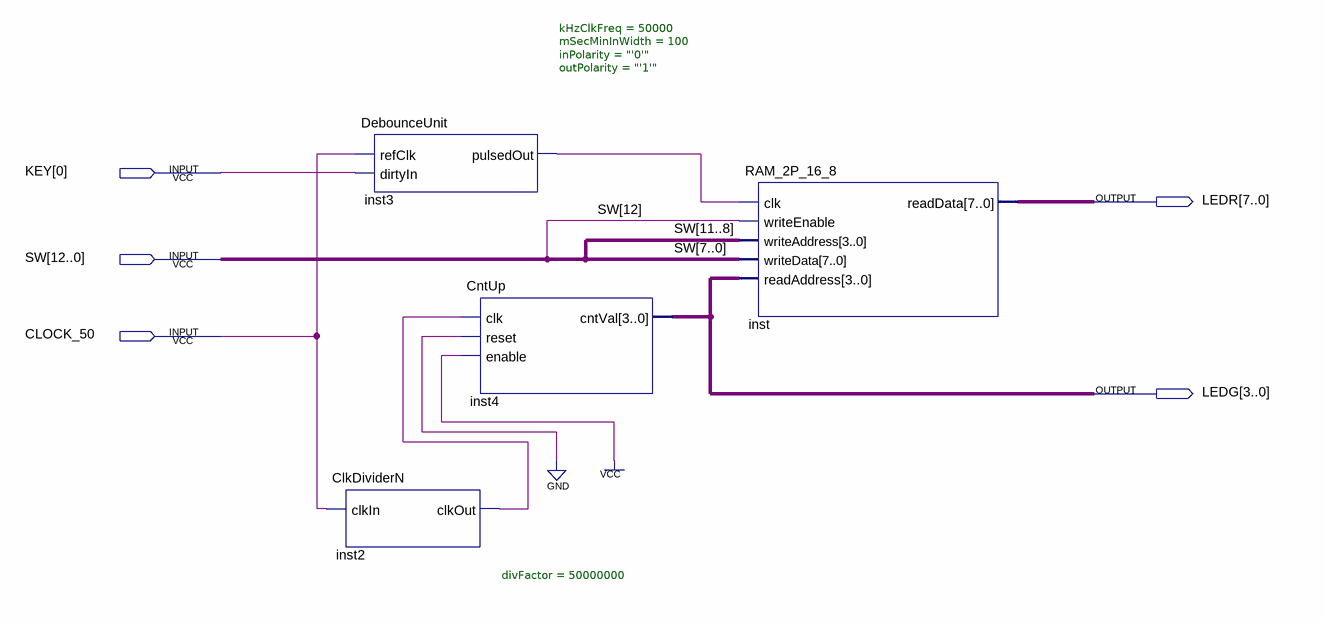
[diagram p0: schematic sheet]
// Quartus schematic RAM_2P_Demo.bdf as structural Verilog: 4 symbols, 5 pins
module RAM_2P_Demo (
  input  [0:0] KEY,
  input  [12:0] SW,
  input  CLOCK_50,
  output [7:0] LEDR,
  output [3:0] LEDG
);

  wire inst2_clkout, inst3_pulsedout;

  ClkDividerN #(.divFactor(50000000)) inst2 (.clkIn(CLOCK_50), .clkOut(inst2_clkout));
  DebounceUnit #(.kHzClkFreq(50000), .mSecMinInWidth(100), .inPolarity("'0'"), .outPolarity("'1'")) inst3 (
    .refClk(CLOCK_50), .dirtyIn(KEY[0]), .pulsedOut(inst3_pulsedout));
  CntUp inst4 (.clk(inst2_clkout), .reset(1'b0), .enable(1'b1), .cntVal(LEDG));
  RAM_2P_16_8 inst (
    .clk(inst3_pulsedout), .writeEnable(SW[12]), .writeAddress(SW[11:8]), .writeData(SW[7:0]),
    .readAddress(LEDG), .readData(LEDR));
endmodule
